# EAGLE design Buttons (EAGLE 9.6.2)
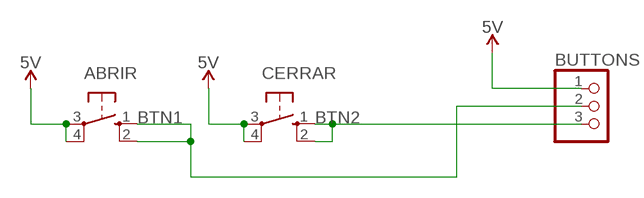
[diagram p0: schematic, sheet 1]

## Parts
ABRIR  10-XX  [B3F-10XX]
BUTTONS  PINHD-1X3  [1X03]
CERRAR  10-XX  [B3F-10XX]

## Nets
5V: ABRIR.3(P) ABRIR.4(P1) BUTTONS.1 CERRAR.3(P) CERRAR.4(P1)
BTN1: ABRIR.1(S) ABRIR.2(S1) BUTTONS.2
BTN2: BUTTONS.3 CERRAR.1(S) CERRAR.2(S1)

## Library data of the parts
ABRIR CERRAR = switch-omron:10-XX: OMRON SWITCH; MPN: B3F-1000; OC_FARNELL: 176432; OC_NEWARK: 36M3542
BUTTONS = daveware_2020:PINHD-1X3: PIN HEADER

## Board
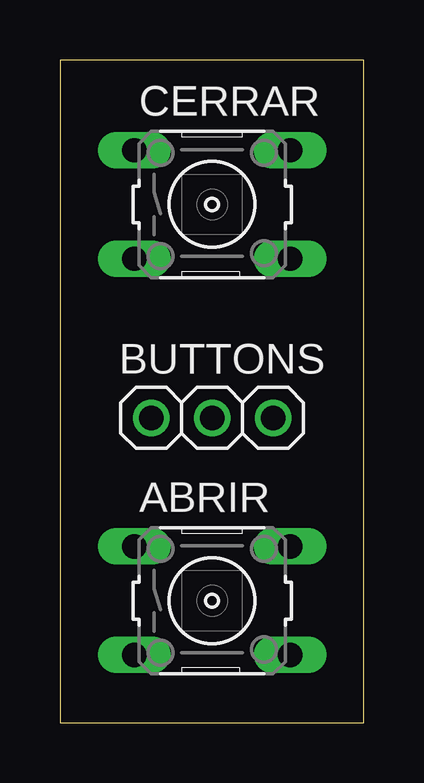
[diagram p1: board, top side]
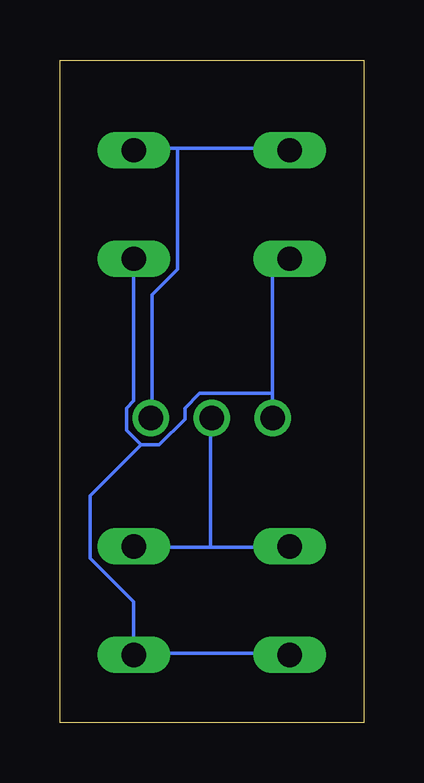
[diagram p2: board, bottom side, seen from below]

Size 12.68 x 27.61 mm. Coordinates in mm from the lower left corner, seen from the top.
Outline: 0,0 12.68,0 12.68,27.61 0,27.61 0,0
Copper layers (1*16): Top 0.035mm / dielectric 1.5mm / Bottom 0.035mm
Design rules "default": minimum track width 6mil, minimum drill 0.35mm, track to track 6mil, track to pad 6mil, pad to pad 6mil, via to via 6mil, smd to smd 6mil, copper to edge 40mil, drill to drill 6mil, minimum pad ring 10mil, minimum via ring 8mil, stop-mask expansion 4mil, vias tented up to drill 0mil, thermal gap 10mil

### Footprints (pad centres in the part's own frame; a part is rotated, then mirrored left to right if it is on the bottom)
B3F-10XX = drill 1.016 long: 1 -3.251,2.261; 2 3.251,2.261; 3 -3.251,-2.261; 4 3.251,-2.261
1X03 = drill 1.016: 1 -2.54,0; 2 0,0; 3 2.54,0

### Placement (x,y rotation side)
ABRIR  6.35,5.08 0 top
BUTTONS  6.35,12.7 0 top
CERRAR  6.35,21.59 0 top

### Tracks (layer width: path | path; a pad name or v marks a point on that pad's centre or on a via)
5V
  Bottom 0.152: 9.6,2.9 3.2,2.9 ABRIR.3 | 3.81,13.72 3.81,18.59 3.2,19.2 CERRAR.3 | 3.81,13.72 BUTTONS.1 | CERRAR.4 9.6,13.41 9.91,13.11 9.91,12.19 9.3,11.58 | 9.3,11.58 8.53,11.58 7.47,12.65 7.47,13.11 6.86,13.72 3.81,13.72 | 9.6,2.9 9.6,5.03 11.43,6.86 11.43,9.45 9.3,11.58 | 9.6,2.9 ABRIR.4
BTN1
  Bottom 0.152: 6.4,7.32 9.6,7.32 ABRIR.2 | 6.4,7.32 3.2,7.32 ABRIR.1 | 6.4,7.32 6.4,12.65 BUTTONS.2
BTN2
  Bottom 0.152: 7.77,23.93 9.6,23.93 CERRAR.2 | 7.77,23.93 3.2,23.93 CERRAR.1 | 7.77,23.93 7.77,18.9 8.84,17.83 8.84,12.8 BUTTONS.3